# EAGLE schematic racing_unit (EAGLE 8.0.0)
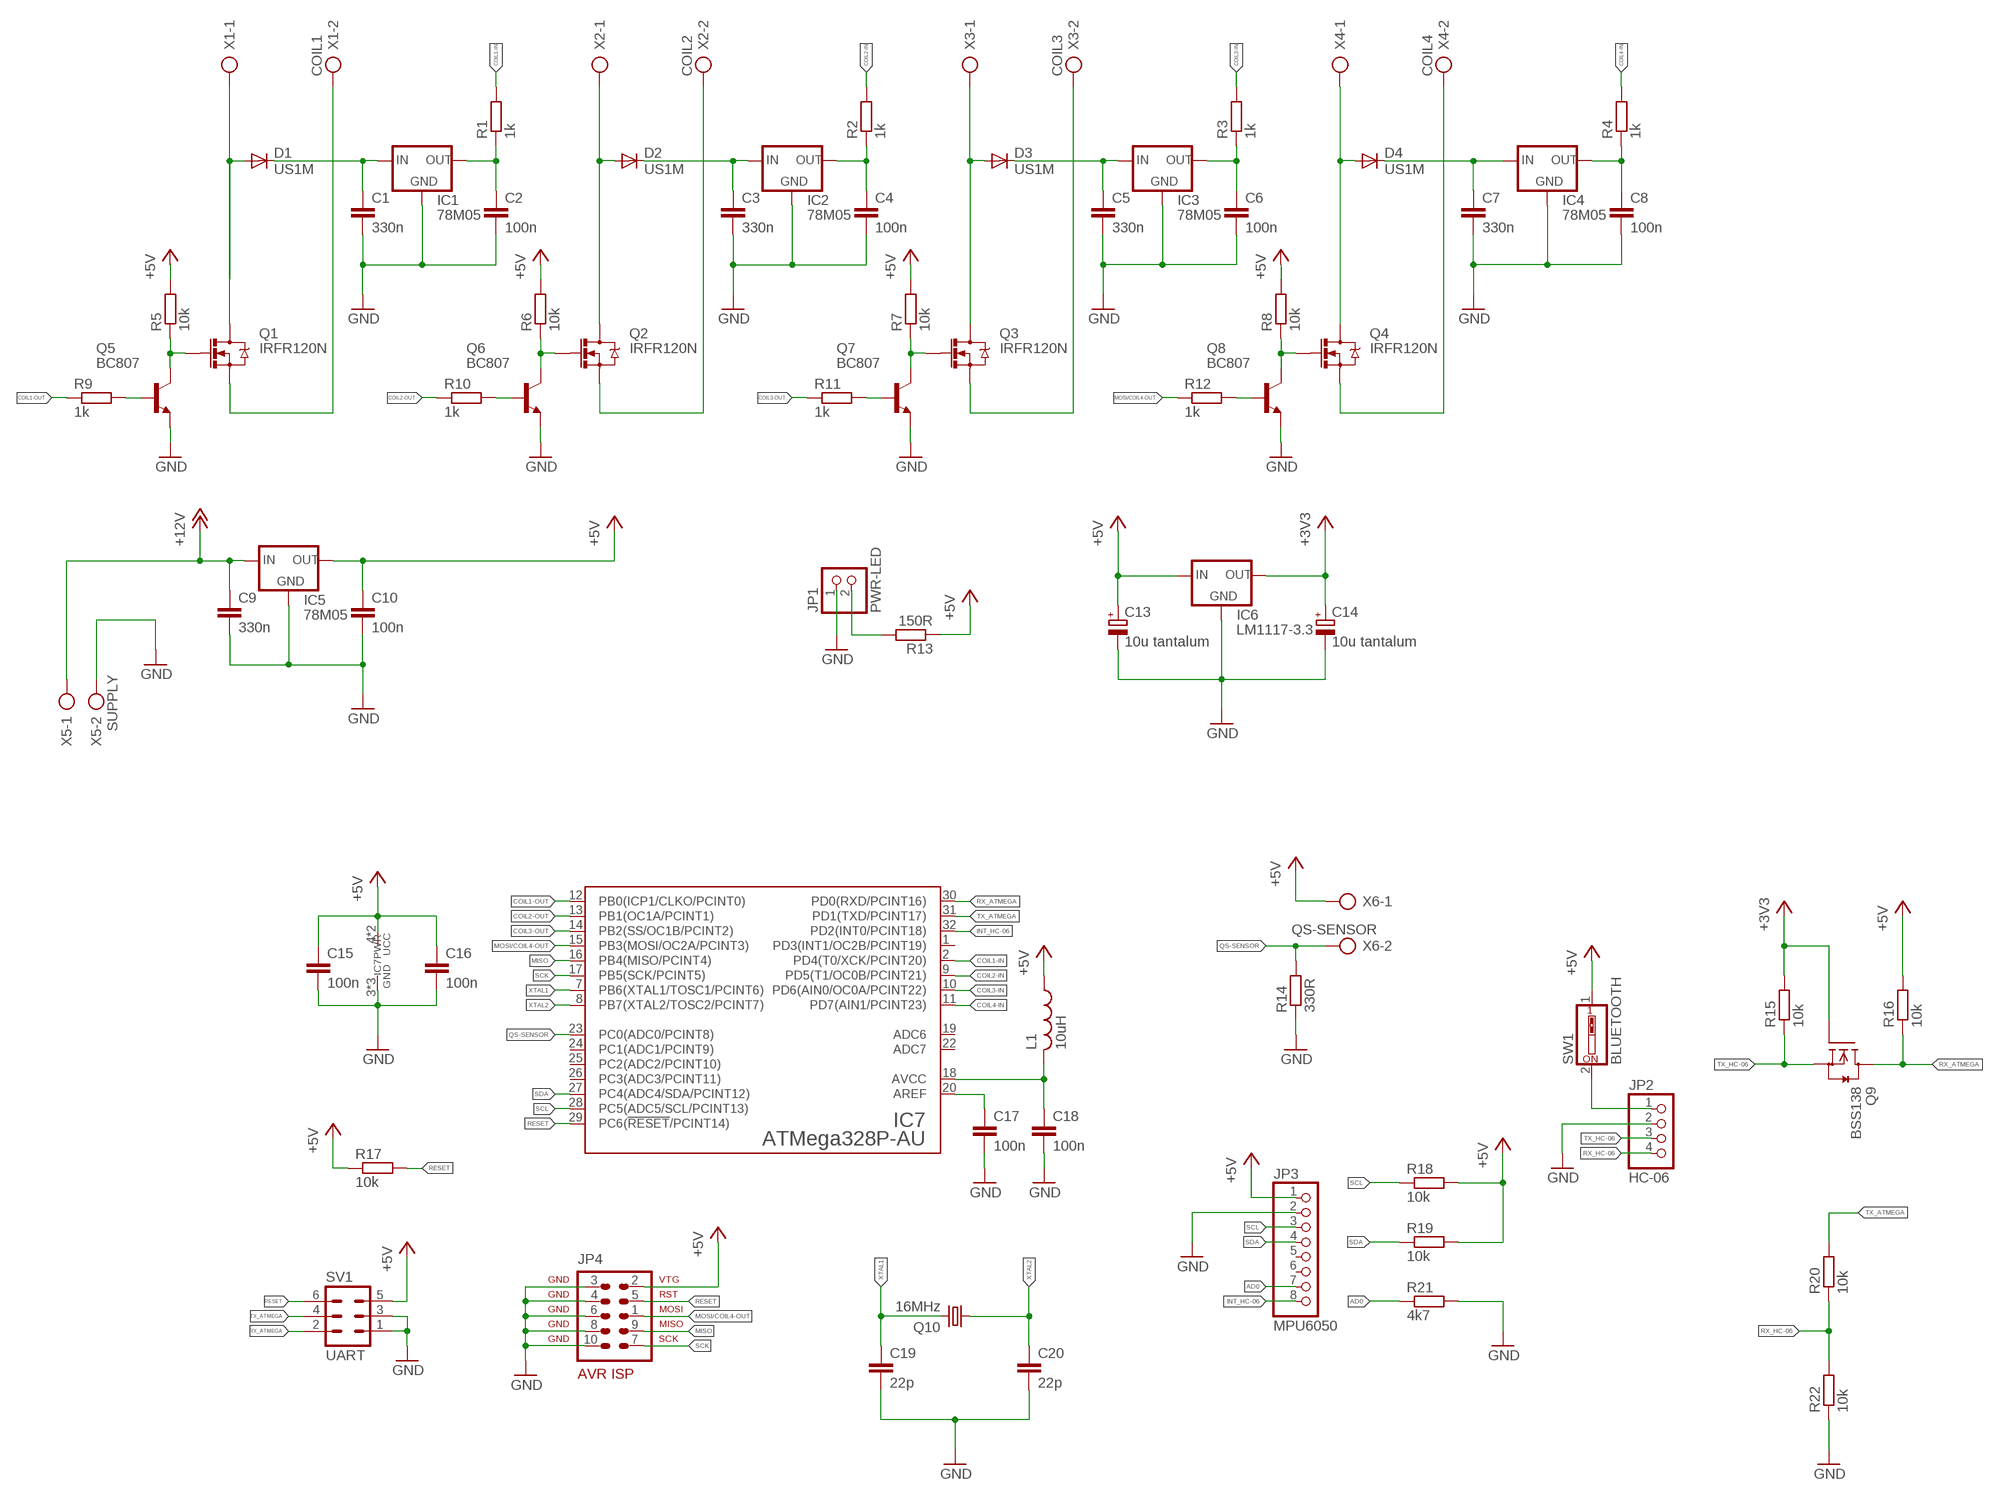
[diagram p0: schematic, sheet 1]

## Parts
C1  330n  C-EUC0805  [C0805]
C2  100n  C-EUC0805  [C0805]
C3  330n  C-EUC0805  [C0805]
C4  100n  C-EUC0805  [C0805]
C5  330n  C-EUC0805  [C0805]
C6  100n  C-EUC0805  [C0805]
C7  330n  C-EUC0805  [C0805]
C8  100n  C-EUC0805  [C0805]
C9  330n  C-EUC0805  [C0805]
C10  100n  C-EUC0805  [C0805]
C13  10u tantalum  CPOL-EUA/3216-18R  [A/3216-18R]
C14  10u tantalum  CPOL-EUA/3216-18R  [A/3216-18R]
C15  100n  C-EUC0805  [C0805]
C16  100n  C-EUC0805  [C0805]
C17  100n  C-EUC0805  [C0805]
C18  100n  C-EUC0805  [C0805]
C19  22p  C-EUC0805  [C0805]
C20  22p  C-EUC0805  [C0805]
D1  US1M  DIODE-DO214AC  [DO214AC]
D2  US1M  DIODE-DO214AC  [DO214AC]
D3  US1M  DIODE-DO214AC  [DO214AC]
D4  US1M  DIODE-DO214AC  [DO214AC]
IC1  78M05  LM1117TO252  [TO252]
IC2  78M05  LM1117TO252  [TO252]
IC3  78M05  LM1117TO252  [TO252]
IC4  78M05  LM1117TO252  [TO252]
IC5  78M05  LM1117TO252  [TO252]
IC6  LM1117-3.3  LM1117  [SOT223]
IC7  ATMega328P-AU  ATMEGA48/88/168/328-AU  [TQFP32-08]
JP1  PWR-LED  PINHD-1X2  [1X02]
JP2  HC-06  PINHD-1X4  [1X04]
JP3  MPU6050  PINHD-1X8  [1X08]
JP4  AVR-ISP-10ML  [ML10]
L1  10uH  L-US0207/10  [0207/10]
Q1  IRFR120N  MOSFET-NCHANNEL_D-PAK  [D-PAK_TO252AA]
Q2  IRFR120N  MOSFET-NCHANNEL_D-PAK  [D-PAK_TO252AA]
Q3  IRFR120N  MOSFET-NCHANNEL_D-PAK  [D-PAK_TO252AA]
Q4  IRFR120N  MOSFET-NCHANNEL_D-PAK  [D-PAK_TO252AA]
Q5  BC807  BC817-16LT1SMD  [SOT23-BEC]
Q6  BC807  BC817-16LT1SMD  [SOT23-BEC]
Q7  BC807  BC817-16LT1SMD  [SOT23-BEC]
Q8  BC807  BC817-16LT1SMD  [SOT23-BEC]
Q9  BSS138  [SOT23]
Q10  16MHz  CRYSTALHC49S  [HC49/S]
R1  1k  R-EU_M0805  [M0805]
R2  1k  R-EU_M0805  [M0805]
R3  1k  R-EU_M0805  [M0805]
R4  1k  R-EU_M0805  [M0805]
R5  10k  R-EU_M0805  [M0805]
R6  10k  R-EU_M0805  [M0805]
R7  10k  R-EU_M0805  [M0805]
R8  10k  R-EU_M0805  [M0805]
R9  1k  R-EU_M0805  [M0805]
R10  1k  R-EU_M0805  [M0805]
R11  1k  R-EU_M0805  [M0805]
R12  1k  R-EU_M0805  [M0805]
R13  150R  R-EU_0204/5  [0204/5]
R14  330R  R-EU_0204/5  [0204/5]
R15  10k  R-EU_M0805  [M0805]
R16  10k  R-EU_M0805  [M0805]
R17  10k  R-EU_M0805  [M0805]
R18  10k  R-EU_M0805  [M0805]
R19  10k  R-EU_M0805  [M0805]
R20  10k  R-EU_M0805  [M0805]
R21  4k7  R-EU_M0805  [M0805]
R22  10k  R-EU_M0805  [M0805]
SV1  UART  ML6  [ML6]
SW1  BLUETOOTH  SW_DIP-1  [EDG-01]
X1  COIL1  AK500/2  [AK500/2]
X2  COIL2  AK500/2  [AK500/2]
X3  COIL3  AK500/2  [AK500/2]
X4  COIL4  AK500/2  [AK500/2]
X5  SUPPLY  AK500/2  [AK500/2]
X6  QS-SENSOR  AK500/2  [AK500/2]

## Nets
+3V3: C14.+ IC6.2(OUT) Q9.1(G) R15.2
+5V: C10.1 C13.+ C15.1 C16.1 IC5.3(OUT) IC6.3(IN) IC7.4(UCC) IC7.6(UCC) JP3.1 JP4.2 L1.1 R5.2 R6.2 R7.2 R8.2 R13.1 R16.2 R17.1 R18.2 R19.2 SV1.5 SW1.1 X6.1
+12V: C9.1 IC5.2(IN) X5.1
AD0: JP3.7 R21.1
COIL1-IN: IC7.2(PD4(T0/XCK/PCINT20)) R1.2
COIL1-OUT: IC7.12(PB0(ICP1/CLKO/PCINT0)) R9.1
COIL2-IN: IC7.9(PD5(T1/OC0B/PCINT21)) R2.2
COIL2-OUT: IC7.13(PB1(OC1A/PCINT1)) R10.1
COIL3-IN: IC7.10(PD6(AIN0/OC0A/PCINT22)) R3.2
COIL3-OUT: IC7.14(PB2(SS/OC1B/PCINT2)) R11.1
COIL4-IN: IC7.11(PD7(AIN1/PCINT23)) R4.2
GND: C1.2 C2.2 C3.2 C4.2 C5.2 C6.2 C7.2 C8.2 C9.2 C10.2 C13.- C14.- C15.2 C16.2 C17.2 C18.2 C19.2 C20.2 IC1.1(GND) IC2.1(GND) IC3.1(GND) IC4.1(GND) IC5.1(GND) IC6.1(GND) IC7.3(GND) IC7.5(GND) IC7.21(GND) JP1.1 JP2.2 JP3.2 JP4.3 JP4.4 JP4.6 JP4.8 JP4.10 Q5.E Q6.E Q7.E Q8.E R14.1 R21.2 R22.1 SV1.1 SV1.3 X5.2
INT_HC-06: IC7.32(PD2(INT0/PCINT18)) JP3.8
MISO: IC7.16(PB4(MISO/PCINT4)) JP4.9
MOSI/COIL4-OUT: IC7.15(PB3(MOSI/OC2A/PCINT3)) JP4.1 R12.1
N$1: D1.A Q1.2(D) X1.1
N$2: D2.A Q2.2(D) X2.1
N$3: D3.A Q3.2(D) X3.1
N$4: D4.A Q4.2(D) X4.1
N$5: C17.1 IC7.20(AREF)
N$6: C18.1 IC7.18(AVCC) L1.2
N$7: Q5.B R9.2
N$8: Q6.B R10.2
N$9: Q4.3(S) X4.2
N$10: Q3.3(S) X3.2
N$11: Q2.3(S) X2.2
N$12: Q1.3(S) X1.2
N$13: JP1.2 R13.2
N$14: C2.1 IC1.3(OUT) R1.1
N$15: C4.1 IC2.3(OUT) R2.1
N$16: Q7.B R11.2
N$17: C8.1 IC4.3(OUT) R4.1
N$18: C6.1 IC3.3(OUT) R3.1
N$19: Q8.B R12.2
N$20: JP2.1 SW1.2
N$21: C1.1 D1.C IC1.2(IN)
N$22: C3.1 D2.C IC2.2(IN)
N$23: C5.1 D3.C IC3.2(IN)
N$24: C7.1 D4.C IC4.2(IN)
N$123: Q1.1(G) Q5.C R5.1
N$124: Q2.1(G) Q6.C R6.1
N$125: Q3.1(G) Q7.C R7.1
N$126: Q4.1(G) Q8.C R8.1
QS-SENSOR: IC7.23(PC0(ADC0/PCINT8)) R14.2 X6.2
RESET: IC7.29(PC6(!RESET!/PCINT14)) JP4.5 R17.2 SV1.6
RX_ATMEGA: IC7.30(PD0(RXD/PCINT16)) Q9.3(D) R16.1 SV1.2
RX_HC-06: JP2.4 R20.1 R22.2
SCK: IC7.17(PB5(SCK/PCINT5)) JP4.7
SCL: IC7.28(PC5(ADC5/SCL/PCINT13)) JP3.3 R18.1
SDA: IC7.27(PC4(ADC4/SDA/PCINT12)) JP3.4 R19.1
TX_ATMEGA: IC7.31(PD1(TXD/PCINT17)) R20.2 SV1.4
TX_HC-06: JP2.3 Q9.2(S) R15.1
XTAL1: C19.1 IC7.7(PB6(XTAL1/TOSC1/PCINT6)) Q10.2
XTAL2: C20.1 IC7.8(PB7(XTAL2/TOSC2/PCINT7)) Q10.1
Unconnected: IC7.1(PD3(INT1/OC2B/PCINT19)) IC7.19(ADC6) IC7.22(ADC7) IC7.24(PC1(ADC1/PCINT9)) IC7.25(PC2(ADC2/PCINT10)) IC7.26(PC3(ADC3/PCINT11)) JP3.5 JP3.6

## Library data of the parts
C1-C10 C15-C20 = rcl:C-EU: CAPACITOR, European symbol
C13 C14 = rcl:CPOL-EU: POLARIZED CAPACITOR, European symbol
D1-D4 = diode:DIODE-: DIODE
IC1-IC6 = v-reg-2:LM1117
IC7 = atmel_tiny24-44-84tiny48-88mega48-88-168-328:ATMEGA48/88/168/328
JP1 = pinhead:PINHD-1X2: PIN HEADER
JP2 = pinhead:PINHD-1X4: PIN HEADER
JP3 = pinhead:PINHD-1X8: PIN HEADER
JP4 = atmel-1:AVR-ISP-10: AVR ISP-10 Serial Programming Header
L1 = rcl:L-US: INDUCTOR, American symbol
Q1-Q4 = Simplex-DiscreteSemi:MOSFET-NCHANNEL: Generic N-channel mosfet
Q5-Q8 = transistor-npn:BC817*: NPN Transistor
Q9 = m-pad-2.1:BSS138: Fairchild Semiconductors BSS138 N-Channel Logic Level Enhancement Mode Field Effect Transistor General Description: These N-Channel enhancement mode field effect transistors are produced using Fairchild's proprietary, high cell density, DMOS technology. These products have been designed to minimize on-state resistance while provide rugged, reliable, and fast switching performance.These products are particularly suited for low voltage, low current applications such as small servo motor control, power MOSFET gate drivers, and other switching applications. Features: 0.22 A, 50 V. RDS(ON) = 3.5Ohm @ VGS = 10 V RDS(ON) = 6.0Ohm @ VGS = 4.5 V High density cell design for extremely low RDS(ON) Rugged and Reliable Compact industry standard SOT-23 surface mount package Please send any comments to: messi@users.sourceforge.net
Q10 = crystal:CRYSTAL: CRYSTAL; OC_FARNELL: 1667008; OC_NEWARK: unknown
R1-R12 R15-R22 = rcl:R-EU_: RESISTOR, European symbol
R13 R14 = resistor:R-EU_: RESISTOR, European symbol
SV1 = con-harting-ml:ML6: HARTING; OC_FARNELL: unknown; OC_NEWARK: unknown
SW1 = special:SW_DIP-1: DIP SWITCH
X1-X6 = con-ptr500:AK500/2: CONNECTOR; OC_FARNELL: unknown; OC_NEWARK: unknown